# Altium schematic sheet Sheet1.SchDoc
size A
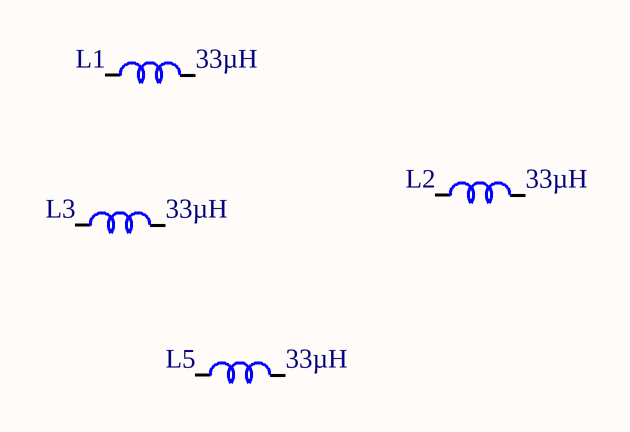
[diagram p0: Sheet1.SchDoc]

## Parts
L1  value 33µH  [7443633300]  (hidden comment: 7443633300)
L2  value 33µH  [7443633300]  (hidden comment: 7443633300)
L3  value 33µH  [7443633300]  (hidden comment: 7443633300)
L5  value 33µH  [7443633300]  (hidden comment: 7443633300)

## Nets

Not connected (* = marked no-connect by the designer): L1 1 2; L2 1 2; L3 1 2; L5 1 2

## Library data of the parts
L1-L3 L5 = CMP-ROOT-00000-5: FIXED IND 33UH 12A 11.4 MOHM SMD; part_no: 123456; Manufacturer: Wurth Electronics; Inductance Frequency - Test: 100 kHz; Tolerance: ±15%; Current - Saturation: 11A; Frequency - Self Resonant: 12MHz; ComponentLink1Description: Datasheet; Current Rating: 12A; Supplier 1: Digi-Key; Component Name: 7443633300; Source: Schlib1_Test.SchLib; Supplier Part Number 1: 732-2524-1-ND; Manufacturer Part Number: 7443633300; ComponentLink1URL: https://katalog.we-online.de/pbs/datasheet/7443633300.pdf; DCR: 11.4 mOhm